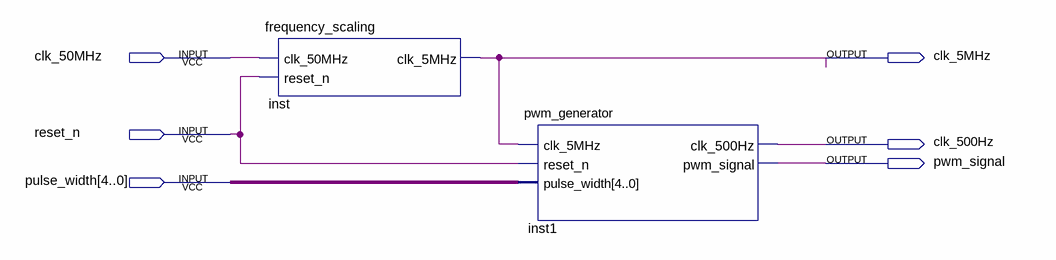
[diagram p0: schematic sheet]
// Quartus schematic t1a_fs_pwm.bdf as structural Verilog: 2 symbols, 6 pins
module t1a_fs_pwm (
  input  clk_50MHz,
  input  reset_n,
  input  [4:0] pulse_width,
  output clk_5MHz,
  output clk_500Hz,
  output pwm_signal
);

  frequency_scaling inst (.clk_50MHz(clk_50MHz), .reset_n(reset_n), .clk_5MHz(clk_5MHz));
  pwm_generator inst1 (
    .clk_5MHz(clk_5MHz), .reset_n(reset_n), .pulse_width(pulse_width), .clk_500Hz(clk_500Hz),
    .pwm_signal(pwm_signal));
endmodule
